# Altium schematic sheet main.SchDoc: Smart MCU Project
size A3; Author: Rinosh Baskaran; SheetNumber: 3; SheetTotal: 2